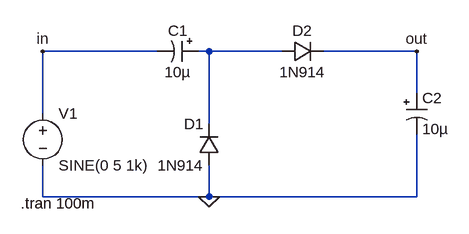
[diagram p0: schematic помножувач.asc]
помножувач.asc, the LTspice schematic file:
Version 4
SHEET 1 880 680
WIRE 48 96 -128 96
WIRE 128 96 112 96
WIRE 240 96 128 96
WIRE 448 96 304 96
WIRE 448 160 448 96
WIRE -128 192 -128 96
WIRE 128 208 128 96
WIRE -128 320 -128 272
WIRE 128 320 128 272
WIRE 128 320 -128 320
WIRE 448 320 448 224
WIRE 448 320 128 320
FLAG 128 320 0
FLAG 448 96 out
FLAG -128 96 in
SYMBOL diode 144 272 R180
WINDOW 0 24 64 Left 2
WINDOW 3 24 0 Left 2
SYMATTR InstName D1
SYMATTR Value 1N914
SYMBOL diode 240 112 R270
WINDOW 0 32 32 VTop 2
WINDOW 3 0 32 VBottom 2
SYMATTR InstName D2
SYMATTR Value 1N914
SYMBOL polcap 112 80 R90
WINDOW 0 0 32 VBottom 2
WINDOW 3 32 32 VTop 2
SYMATTR InstName C1
SYMATTR Value 10µ
SYMATTR Description Capacitor
SYMATTR Type cap
SYMATTR SpiceLine V=16 Irms=2.44949 Rser=0.045 Lser=0
SYMBOL polcap 432 160 R0
SYMATTR InstName C2
SYMATTR Value 10µ
SYMATTR Description Capacitor
SYMATTR Type cap
SYMATTR SpiceLine V=16 Irms=3.72678 Rser=0.018 Lser=0
SYMBOL voltage -128 176 R0
WINDOW 123 0 0 Left 2
WINDOW 39 0 0 Left 2
SYMATTR InstName V1
SYMATTR Value SINE(0 5 1k)
TEXT -162 330 Left 2 !.tran 100m

The netlist it stands for:
* помножувач.asc
D1 0 N001 1N914
D2 N001 out 1N914
C1 N001 in 10µ V=16 Irms=2.44949 Rser=0.045 Lser=0
C2 out 0 10µ V=16 Irms=3.72678 Rser=0.018 Lser=0
V1 in 0 SINE(0 5 1k)
.model D D
.lib standard.dio
.tran 100m
.backanno
.end

* Results of the author's LTspice run, read from the files saved beside the schematic
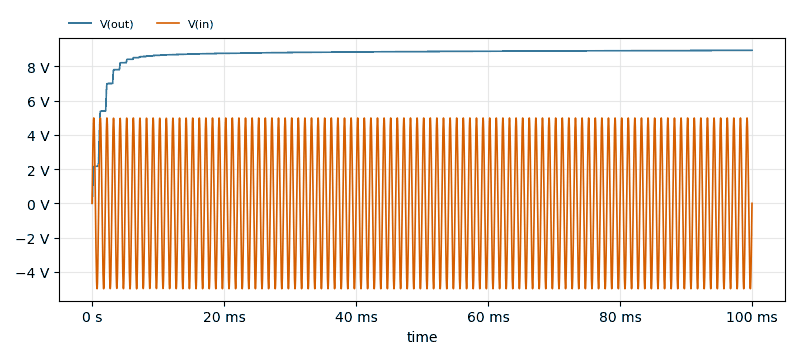
[diagram p1: Transient Analysis of помножувач.asc, plotted from the saved traces]
* Transient Analysis, 1 run:
*   V(out): min 0 V, max 8.94 V, average 8.698 V, rms 8.737 V, last 8.94 V
*   V(in): min -4.993 V, max 4.99 V, average -152.5 µV, rms 3.529 V, last 0 V